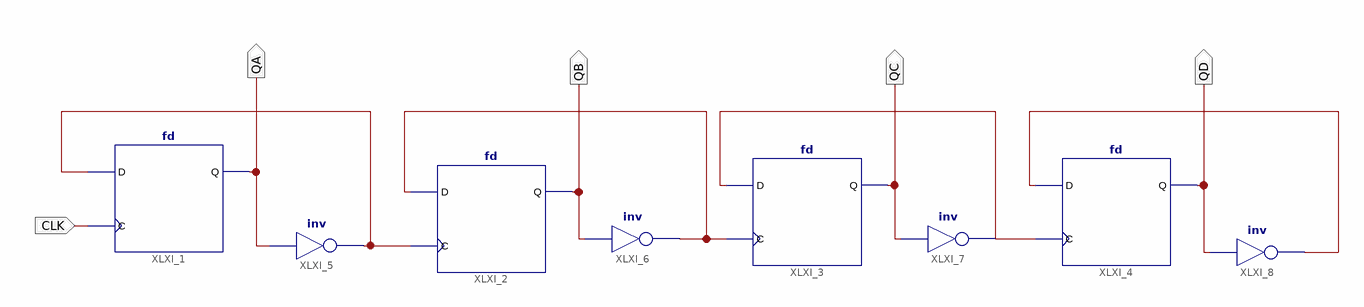
[diagram p0: schematic sheet 1]
// Xilinx ISE schematic counter.sch (spartan3a) as structural Verilog: 8 symbols, 5 ports
module counter (
  input  CLK,
  output QA,
  output QB,
  output QC,
  output QD
);

  wire XLXN_3, XLXN_6, XLXN_9, XLXN_13;

  fd XLXI_1 (.C(CLK), .D(XLXN_3), .Q(QA));
  not XLXI_5 (XLXN_3, QA);
  not XLXI_6 (XLXN_6, QB);
  fd XLXI_3 (.C(XLXN_6), .D(XLXN_9), .Q(QC));
  fd XLXI_2 (.C(XLXN_3), .D(XLXN_6), .Q(QB));
  not XLXI_7 (XLXN_9, QC);
  fd XLXI_4 (.C(XLXN_9), .D(XLXN_13), .Q(QD));
  not XLXI_8 (XLXN_13, QD);
endmodule
